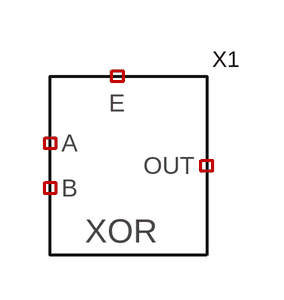
[diagram p0: schematic Draft2.asc]
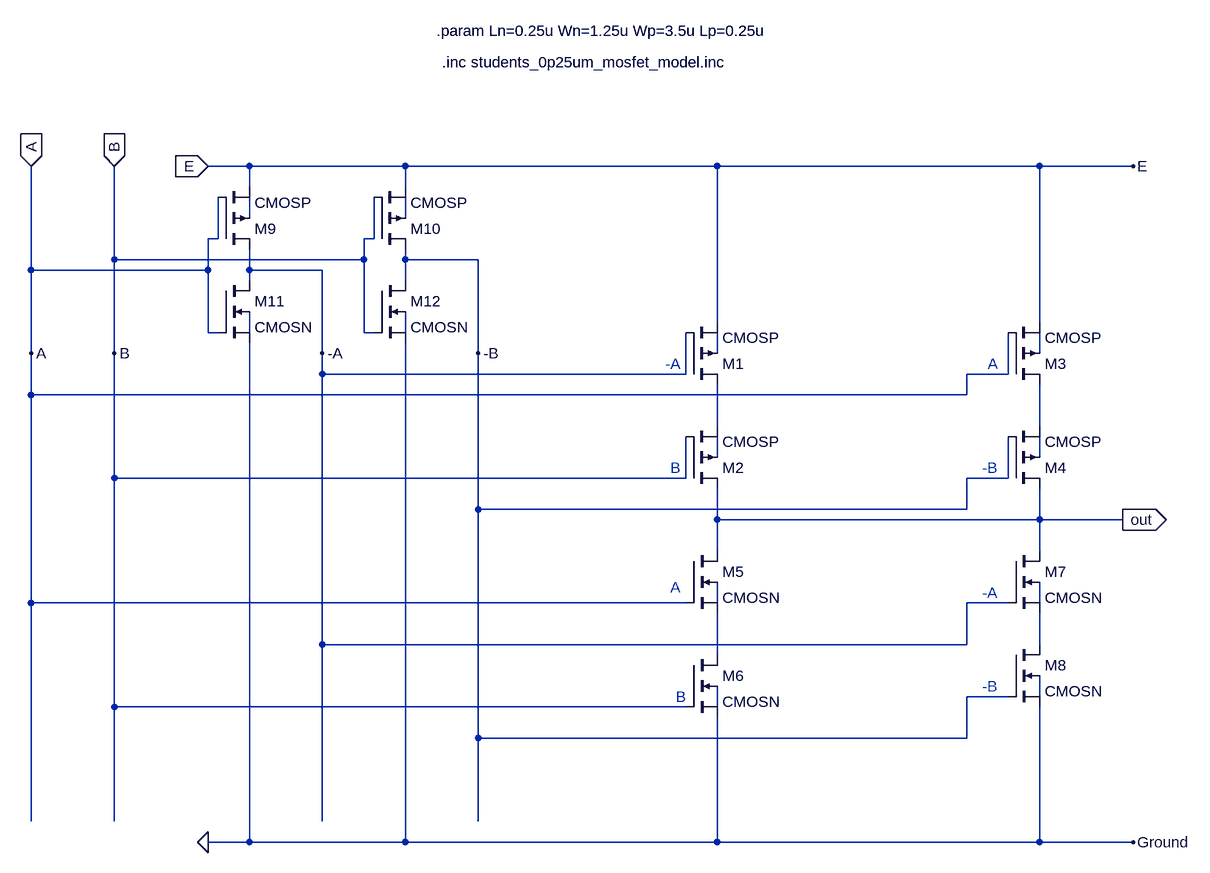
[diagram p1: sub-circuit xor.asc]
Draft2.asc, the LTspice schematic file:
Version 4
SHEET 1 880 680
SYMBOL XOR 192 160 R0
SYMATTR InstName X1

xor.asc, the sub-circuit schematic file:
Version 4
SHEET 1 1268 1300
WIRE -3936 -368 -4000 -368
WIRE -3696 -368 -3936 -368
WIRE -3216 -368 -3696 -368
WIRE -2720 -368 -3216 -368
WIRE -2576 -368 -2720 -368
WIRE -3936 -336 -3936 -368
WIRE -3696 -336 -3696 -368
WIRE -3936 -288 -3936 -320
WIRE -3696 -288 -3696 -320
WIRE -3984 -256 -3984 -320
WIRE -3984 -256 -4000 -256
WIRE -3744 -256 -3744 -320
WIRE -3744 -256 -3760 -256
WIRE -4144 -224 -4144 -368
WIRE -3760 -224 -3760 -256
WIRE -3760 -224 -4144 -224
WIRE -3696 -224 -3696 -240
WIRE -3584 -224 -3696 -224
WIRE -4272 -208 -4272 -368
WIRE -4000 -208 -4000 -256
WIRE -4000 -208 -4272 -208
WIRE -3936 -208 -3936 -240
WIRE -3824 -208 -3936 -208
WIRE -3936 -192 -3936 -208
WIRE -3696 -192 -3696 -224
WIRE -3216 -128 -3216 -368
WIRE -2720 -128 -2720 -368
WIRE -4000 -112 -4000 -208
WIRE -3984 -112 -4000 -112
WIRE -3936 -112 -3936 -144
WIRE -3760 -112 -3760 -224
WIRE -3744 -112 -3760 -112
WIRE -3696 -112 -3696 -144
WIRE -4272 -80 -4272 -208
WIRE -4144 -80 -4144 -224
WIRE -3824 -80 -3824 -208
WIRE -3584 -80 -3584 -224
WIRE -3216 -80 -3216 -112
WIRE -2720 -80 -2720 -112
WIRE -3824 -48 -3824 -80
WIRE -3264 -48 -3264 -112
WIRE -3264 -48 -3824 -48
WIRE -2768 -48 -2768 -112
WIRE -2768 -48 -2832 -48
WIRE -4272 -16 -4272 -80
WIRE -2832 -16 -2832 -48
WIRE -2832 -16 -4272 -16
WIRE -3216 32 -3216 -32
WIRE -2720 32 -2720 -32
WIRE -3216 80 -3216 48
WIRE -2720 80 -2720 48
WIRE -4144 112 -4144 -80
WIRE -3264 112 -3264 48
WIRE -3264 112 -4144 112
WIRE -2768 112 -2768 48
WIRE -2768 112 -2832 112
WIRE -3584 160 -3584 -80
WIRE -2832 160 -2832 112
WIRE -2832 160 -3584 160
WIRE -3216 176 -3216 128
WIRE -2720 176 -2720 128
WIRE -2720 176 -3216 176
WIRE -2592 176 -2720 176
WIRE -3216 224 -3216 176
WIRE -2720 224 -2720 176
WIRE -4272 304 -4272 -16
WIRE -3264 304 -4272 304
WIRE -3216 304 -3216 272
WIRE -2768 304 -2832 304
WIRE -2720 304 -2720 272
WIRE -3824 368 -3824 -48
WIRE -2832 368 -2832 304
WIRE -2832 368 -3824 368
WIRE -2720 368 -2720 320
WIRE -3216 384 -3216 320
WIRE -2768 448 -2832 448
WIRE -2720 448 -2720 416
WIRE -4144 464 -4144 112
WIRE -3264 464 -4144 464
WIRE -3216 464 -3216 432
WIRE -3584 512 -3584 160
WIRE -2832 512 -2832 448
WIRE -2832 512 -3584 512
WIRE -4272 640 -4272 304
WIRE -4144 640 -4144 464
WIRE -3824 640 -3824 368
WIRE -3584 640 -3584 512
WIRE -3936 672 -3936 -96
WIRE -3936 672 -4000 672
WIRE -3696 672 -3696 -96
WIRE -3696 672 -3936 672
WIRE -3216 672 -3216 480
WIRE -3216 672 -3696 672
WIRE -2720 672 -2720 464
WIRE -2720 672 -3216 672
WIRE -2576 672 -2720 672
FLAG -2576 -368 E
FLAG -2576 672 Ground
FLAG -4144 -80 B
FLAG -4272 -80 A
FLAG -2592 176 out
IOPIN -2592 176 Out
FLAG -3824 -80 -A
FLAG -3584 -80 -B
FLAG -4272 -368 A
IOPIN -4272 -368 In
FLAG -4144 -368 B
IOPIN -4144 -368 In
FLAG -4000 -368 E
IOPIN -4000 -368 In
FLAG -4000 672 0
SYMBOL pmos4 -3264 -32 M180
SYMATTR InstName M1
SYMATTR Value CMOSP
SYMATTR Value2 l=Lp w=Wp
SYMBOL pmos4 -3264 128 M180
SYMATTR InstName M2
SYMATTR Value CMOSP
SYMATTR Value2 l=Lp w=Wp
SYMBOL pmos4 -2768 -32 M180
SYMATTR InstName M3
SYMATTR Value CMOSP
SYMATTR Value2 l=Lp w=Wp
SYMBOL pmos4 -2768 128 M180
SYMATTR InstName M4
SYMATTR Value CMOSP
SYMATTR Value2 l=Lp w=Wp
SYMBOL nmos4 -3264 224 R0
SYMATTR InstName M5
SYMATTR Value CMOSN
SYMATTR Value2 l=Ln w=Wn
SYMBOL nmos4 -3264 384 R0
SYMATTR InstName M6
SYMATTR Value CMOSN
SYMATTR Value2 l=Ln w=Wn
SYMBOL nmos4 -2768 224 R0
SYMATTR InstName M7
SYMATTR Value CMOSN
SYMATTR Value2 l=Ln w=Wn
SYMBOL nmos4 -2768 368 R0
SYMATTR InstName M8
SYMATTR Value CMOSN
SYMATTR Value2 l=Ln w=Wn
SYMBOL pmos4 -3984 -240 M180
SYMATTR InstName M9
SYMATTR Value CMOSP
SYMATTR Value2 l=Lp w=Wp
SYMBOL pmos4 -3744 -240 M180
SYMATTR InstName M10
SYMATTR Value CMOSP
SYMATTR Value2 l=Lp w=Wp
SYMBOL nmos4 -3984 -192 R0
SYMATTR InstName M11
SYMATTR Value CMOSN
SYMATTR Value2 l=Ln w=Wn
SYMBOL nmos4 -3744 -192 R0
SYMATTR InstName M12
SYMATTR Value CMOSN
SYMATTR Value2 l=Ln w=Wn
TEXT -2800 -64 Left 2 ;A
TEXT -3288 96 Left 2 ;B
TEXT -3288 280 Left 2 ;A
TEXT -3280 448 Left 2 ;B
TEXT -3296 -64 Left 2 ;-A
TEXT -2808 288 Left 2 ;-A
TEXT -2808 96 Left 2 ;-B
TEXT -2808 432 Left 2 ;-B
TEXT -3648 -576 Left 2 !.param Ln=0.25u Wn=1.25u Wp=3.5u Lp=0.25u
TEXT -3640 -528 Left 2 !.inc students_0p25um_mosfet_model.inc

The netlist it stands for:
* Draft2.asc
XX1 NC_01 NC_02 NC_03 NC_04 xor

* block symbol definitions
.subckt xor E A B OUT
M1 N007 -A E N005 CMOSP l=Lp w=Wp
M2 out B N007 N009 CMOSP l=Lp w=Wp
M3 N008 A E N006 CMOSP l=Lp w=Wp
M4 out -B N008 N010 CMOSP l=Lp w=Wp
M5 out A N014 N011 CMOSN l=Ln w=Wn
M6 N014 B 0 N016 CMOSN l=Ln w=Wn
M7 out -A N013 N012 CMOSN l=Ln w=Wn
M8 N013 -B 0 N015 CMOSN l=Ln w=Wn
M9 -A A E N001 CMOSP l=Lp w=Wp
M10 -B B E N002 CMOSP l=Lp w=Wp
M11 -A A 0 N003 CMOSN l=Ln w=Wn
M12 -B B 0 N004 CMOSN l=Ln w=Wn
* A
* B
* A
* B
* -A
* -A
* -B
* -B
.param Ln=0.25u Wn=1.25u Wp=3.5u Lp=0.25u
.inc students_0p25um_mosfet_model.inc
.ends xor

.model NMOS NMOS
.model PMOS PMOS
.lib standard.mos
.backanno
.end